# EAGLE schematic ZipIT_rev1 (EAGLE 6.5.0)
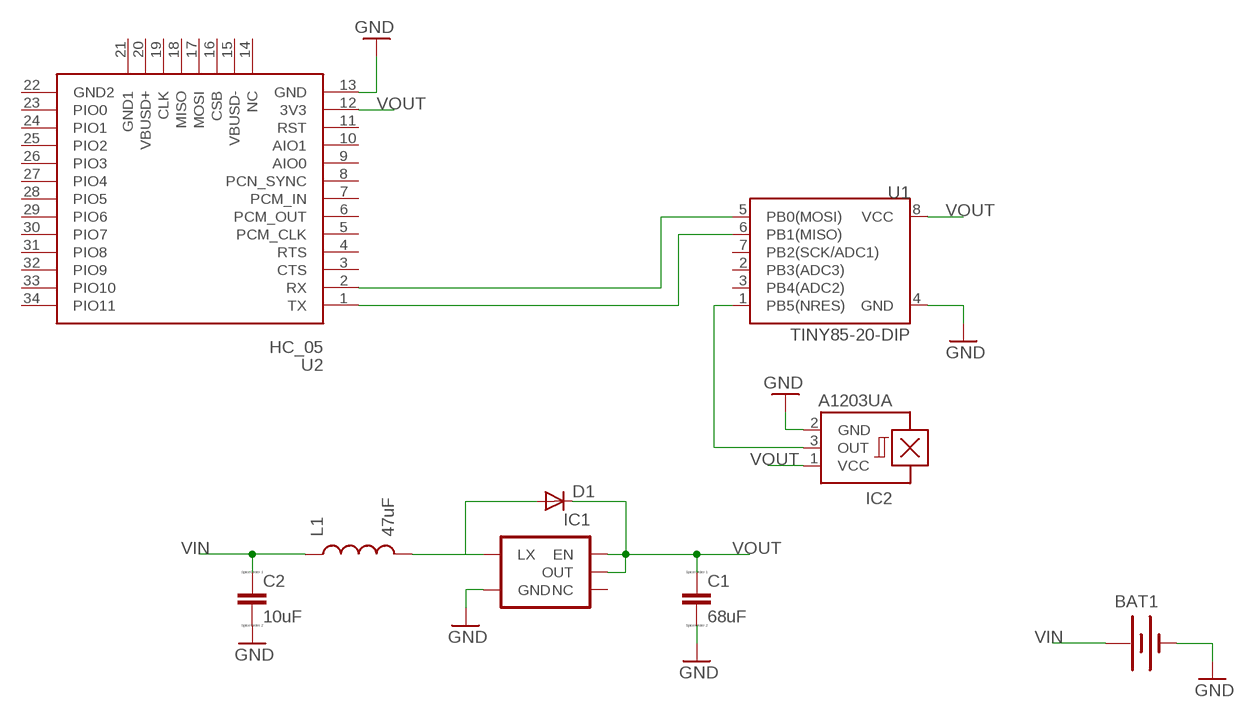
[diagram p0: schematic, sheet 1]

## Parts
BAT1  BATTERYAAA  [BATTERY-AAA]
C1  68uF  CC1210  [C1210]
C2  10uF  CC1206  [C1206]
D1  DIODE-DO214AC  [DO214AC]
IC1  V_REG_NCP1400SOT23-5  [SOT23-5]
IC2  A1203UA  [SIP3-UA]
L1  47uF  INDUCTORCR54  [CR54]
U1  TINY85-20-DIP  ATTINY45TINY85-20-DIP  [DIP08]
U2  HC_05  [BLUETOOTH_SMD]

## Nets
GND: BAT1.GND@1(-) C1.2 C2.2 IC1.4(GND) IC2.2(GND) U1.4(GND) U2.13(GND)
N$1: D1.A IC1.5(LX) L1.P$2
N$2: IC2.3(OUT) U1.1(PB5(NRES))
N$3: U1.6(PB1(MISO)) U2.1(TX)
N$4: U1.5(PB0(MOSI)) U2.2(RX)
VIN: BAT1.PWR@1(+) C2.1 L1.P$1
VOUT: C1.1 D1.C IC1.1(EN) IC1.2(OUT) IC2.1(VCC) U1.8(VCC) U2.12(3V3)
Unconnected: IC1.3(NC) U1.2(PB3(ADC3)) U1.3(PB4(ADC2)) U1.7(PB2(SCK/ADC1)) U2.3(CTS) U2.4(RTS) U2.5(PCM_CLK) U2.6(PCM_OUT) U2.7(PCM_IN) U2.8(PCN_SYNC) U2.9(AIO0) U2.10(AIO1) U2.11(RST) U2.14(NC) U2.15(VBUSD-) U2.16(CSB) U2.17(MOSI) U2.18(MISO) U2.19(CLK) U2.20(VBUSD+) U2.21(GND1) U2.22(GND2) U2.23(PIO0) U2.24(PIO1) U2.25(PIO2) U2.26(PIO3) U2.27(PIO4) U2.28(PIO5) U2.29(PIO6) U2.30(PIO7) U2.31(PIO8) U2.32(PIO9) U2.33(PIO10) U2.34(PIO11)

## Library data of the parts
BAT1 = SparkFun-Electromechanical:BATTERY: Battery Holders Various common sizes : AA, AAA, 20mm coin cell and 12mm coin cell. 20MM_4LEGS, BATT-10373
C1 C2 = eagle-ltspice:C: CAPACITOR, European symbol; SPICEMODEL: NONE; SPICEPREFIX: C
D1 = diode:DIODE-: DIODE
IC1 = SparkFun-PowerIC:V_REG_NCP1400: Switching step-up voltage regulator NCP1400 switiching regulator takes single cell AA and outputs 100mA at 3.3V or 5V with minimal number of external components.
IC2 = allegro:A12*?: Hall-effect bipolar switch Source: http://www.allegromicro.com/en/Products/Part_Numbers/1202/1202.pdf; OC_FARNELL: 1521672; OC_NEWARK: unknown
L1 = SparkFun-Passives:INDUCTOR: Inductors Basic Inductor/Choke - 0603 and 1206. Footprints are not proven and vary greatly between part numbers. SRN6045- 33uH, 20% 1.4A
U1 = SparkFun-DigitalIC:ATTINY45: Atmel 8-pin 2/4/8kB flash uC; PROD_ID: IC-09445
U2 = SerialPortBluetooth:HC_05